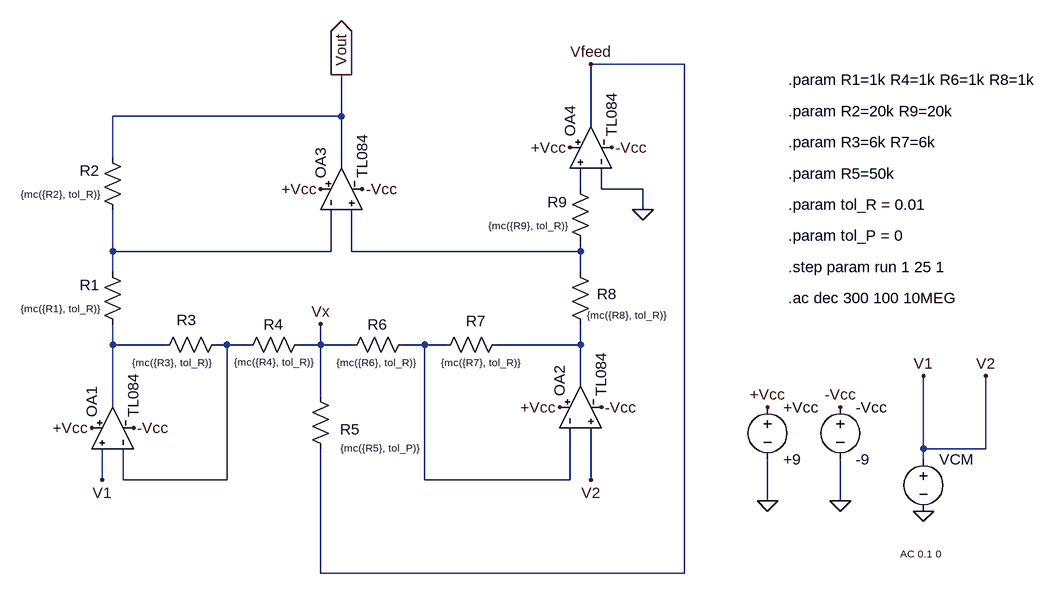
[diagram p0: schematic CM_MonteCarlo.asc]
CM_MonteCarlo.asc, the LTspice schematic file:
Version 4
SHEET 1 1480 940
WIRE 656 -32 512 -32
WIRE 128 48 128 -16
WIRE 128 48 -224 48
WIRE 512 64 512 -32
WIRE -224 112 -224 48
WIRE 128 128 128 48
WIRE 496 160 496 128
WIRE 528 160 528 128
WIRE 592 160 528 160
WIRE 592 192 592 160
WIRE -224 256 -224 192
WIRE 112 256 112 192
WIRE 112 256 -224 256
WIRE 144 256 144 192
WIRE 496 256 496 240
WIRE 496 256 144 256
WIRE -224 288 -224 256
WIRE 496 288 496 256
WIRE -224 400 -224 368
WIRE -144 400 -224 400
WIRE -48 400 -64 400
WIRE -16 400 -48 400
WIRE 96 400 96 368
WIRE 96 400 64 400
WIRE 144 400 96 400
WIRE 256 400 224 400
WIRE 288 400 256 400
WIRE 496 400 496 368
WIRE 496 400 368 400
WIRE 496 464 496 400
WIRE 96 480 96 400
WIRE -224 496 -224 400
WIRE 1024 560 1024 448
WIRE 1120 560 1120 448
WIRE 1120 560 1024 560
WIRE 1024 576 1024 560
WIRE -240 608 -240 560
WIRE -208 608 -208 560
WIRE -48 608 -48 400
WIRE -48 608 -208 608
WIRE 256 608 256 400
WIRE 480 608 480 528
WIRE 480 608 256 608
WIRE 512 608 512 528
WIRE 784 640 784 576
WIRE 896 640 896 576
WIRE 96 752 96 560
WIRE 656 752 656 -32
WIRE 656 752 96 752
FLAG 592 192 0
FLAG 128 -16 Vout
IOPIN 128 -16 Out
FLAG -240 608 V1
FLAG 512 608 V2
FLAG 96 368 Vx
FLAG 512 -32 Vfeed
FLAG 896 496 -Vcc
FLAG 784 496 +Vcc
FLAG 896 640 0
FLAG 784 640 0
FLAG -256 528 +Vcc
FLAG 464 496 +Vcc
FLAG 480 96 +Vcc
FLAG 96 160 +Vcc
FLAG -192 528 -Vcc
FLAG 160 160 -Vcc
FLAG 544 96 -Vcc
FLAG 528 496 -Vcc
FLAG 1024 448 V1
FLAG 1024 656 0
FLAG 1120 448 V2
SYMBOL res -208 384 R180
WINDOW 0 36 76 Left 2
WINDOW 3 36 40 Left 1
SYMATTR InstName R1
SYMATTR Value {mc({R1}, tol_R)}
SYMBOL res -208 208 R180
WINDOW 0 36 76 Left 2
WINDOW 3 36 40 Left 1
SYMATTR InstName R2
SYMATTR Value {mc({R2}, tol_R)}
SYMBOL res -48 384 R90
WINDOW 0 -7 62 VBottom 2
WINDOW 3 33 85 VTop 1
SYMATTR InstName R3
SYMATTR Value {mc({R3}, tol_R)}
SYMBOL res 80 384 R90
WINDOW 0 0 56 VBottom 2
WINDOW 3 32 56 VTop 1
SYMATTR InstName R4
SYMATTR Value {mc({R4}, tol_R)}
SYMBOL res 112 576 R180
WINDOW 0 -45 46 Left 2
WINDOW 3 -135 17 Left 1
SYMATTR InstName R5
SYMATTR Value {mc({R5}, tol_P)}
SYMBOL res 128 416 R270
WINDOW 0 32 56 VTop 2
WINDOW 3 -1 53 VBottom 1
SYMATTR InstName R6
SYMATTR Value {mc({R6}, tol_R)}
SYMBOL res 272 416 R270
WINDOW 0 37 63 VTop 2
WINDOW 3 -1 70 VBottom 1
SYMATTR InstName R7
SYMATTR Value {mc({R7}, tol_R)}
SYMBOL res 480 272 R0
WINDOW 3 26 82 Left 1
WINDOW 0 41 50 Left 2
SYMATTR Value {mc({R8}, tol_R)}
SYMATTR InstName R8
SYMBOL res 512 256 R180
WINDOW 0 36 76 Left 2
WINDOW 3 36 40 Left 1
SYMATTR InstName R9
SYMATTR Value {mc({R9}, tol_R)}
SYMBOL voltage 896 480 R0
SYMATTR InstName -Vcc
SYMATTR Value -9
SYMBOL voltage 784 480 R0
SYMATTR InstName +Vcc
SYMATTR Value +9
SYMBOL voltage 1024 560 R0
WINDOW 3 -76 190 Left 1
WINDOW 123 -36 162 Left 1
WINDOW 39 0 0 Left 0
SYMATTR Value ""
SYMATTR Value2 AC 0.1 0
SYMATTR InstName VCM
SYMBOL FACUsym\\TL084 -224 528 R270
SYMATTR InstName OA1
SYMBOL FACUsym\\TL084 512 96 R270
SYMATTR InstName OA4
SYMBOL FACUsym\\TL084_2 496 496 R270
SYMATTR InstName OA2
SYMBOL FACUsym\\TL084_2 128 160 R270
SYMATTR InstName OA3
TEXT 816 -8 Left 2 !.param R1=1k R4=1k R6=1k R8=1k
TEXT 816 40 Left 2 !.param R2=20k R9=20k
TEXT 816 88 Left 2 !.param R3=6k R7=6k
TEXT 816 136 Left 2 !.param R5=50k
TEXT 816 184 Left 2 !.param tol_R = 0.01
TEXT 816 232 Left 2 !.param tol_P = 0
TEXT 816 280 Left 2 !.step param run 1 25 1
TEXT 816 328 Left 2 !.ac dec 300 100 10MEG

The netlist it stands for:
* CM_MonteCarlo.asc
R1 N004 N002 {mc({R1}, tol_R)}
R2 N002 Vout {mc({R2}, tol_R)}
R3 N005 N004 {mc({R3}, tol_R)}
R4 Vx N005 {mc({R4}, tol_R)}
R5 Vfeed Vx {mc({R5}, tol_P)}
R6 Vx N006 {mc({R6}, tol_R)}
R7 N006 N007 {mc({R7}, tol_R)}
R8 N003 N007 {mc({R8}, tol_R)}
R9 N003 N001 {mc({R9}, tol_R)}
V§-Vcc -Vcc 0 -9
V§+Vcc +Vcc 0 +9
VCM V2 0 AC 0.1 0
XOA1 V2 N005 +Vcc -Vcc N004 TL084 TL084  ; pins In+ In- V+ V- OUT
XOA4 N001 0 +Vcc -Vcc Vfeed TL084 TL084  ; pins In+ In- V+ V- OUT
XOA2 V2 N006 +Vcc -Vcc N007 TL084 TL084  ; pins In+ In- V+ V- OUT
XOA3 N003 N002 +Vcc -Vcc Vout TL084 TL084  ; pins In+ In- V+ V- OUT
.param R1=1k R4=1k R6=1k R8=1k
.param R2=20k R9=20k
.param R3=6k R7=6k
.param R5=50k
.param tol_R = 0.01
.param tol_P = 0
.step param run 1 25 1
.ac dec 300 100 10MEG
.lib FACUsub/TL084.lib
.backanno
.end